# EAGLE schematic TMCM-1110_V21_eagle (EAGLE 6.5.0)

## Sheet 1 of 4
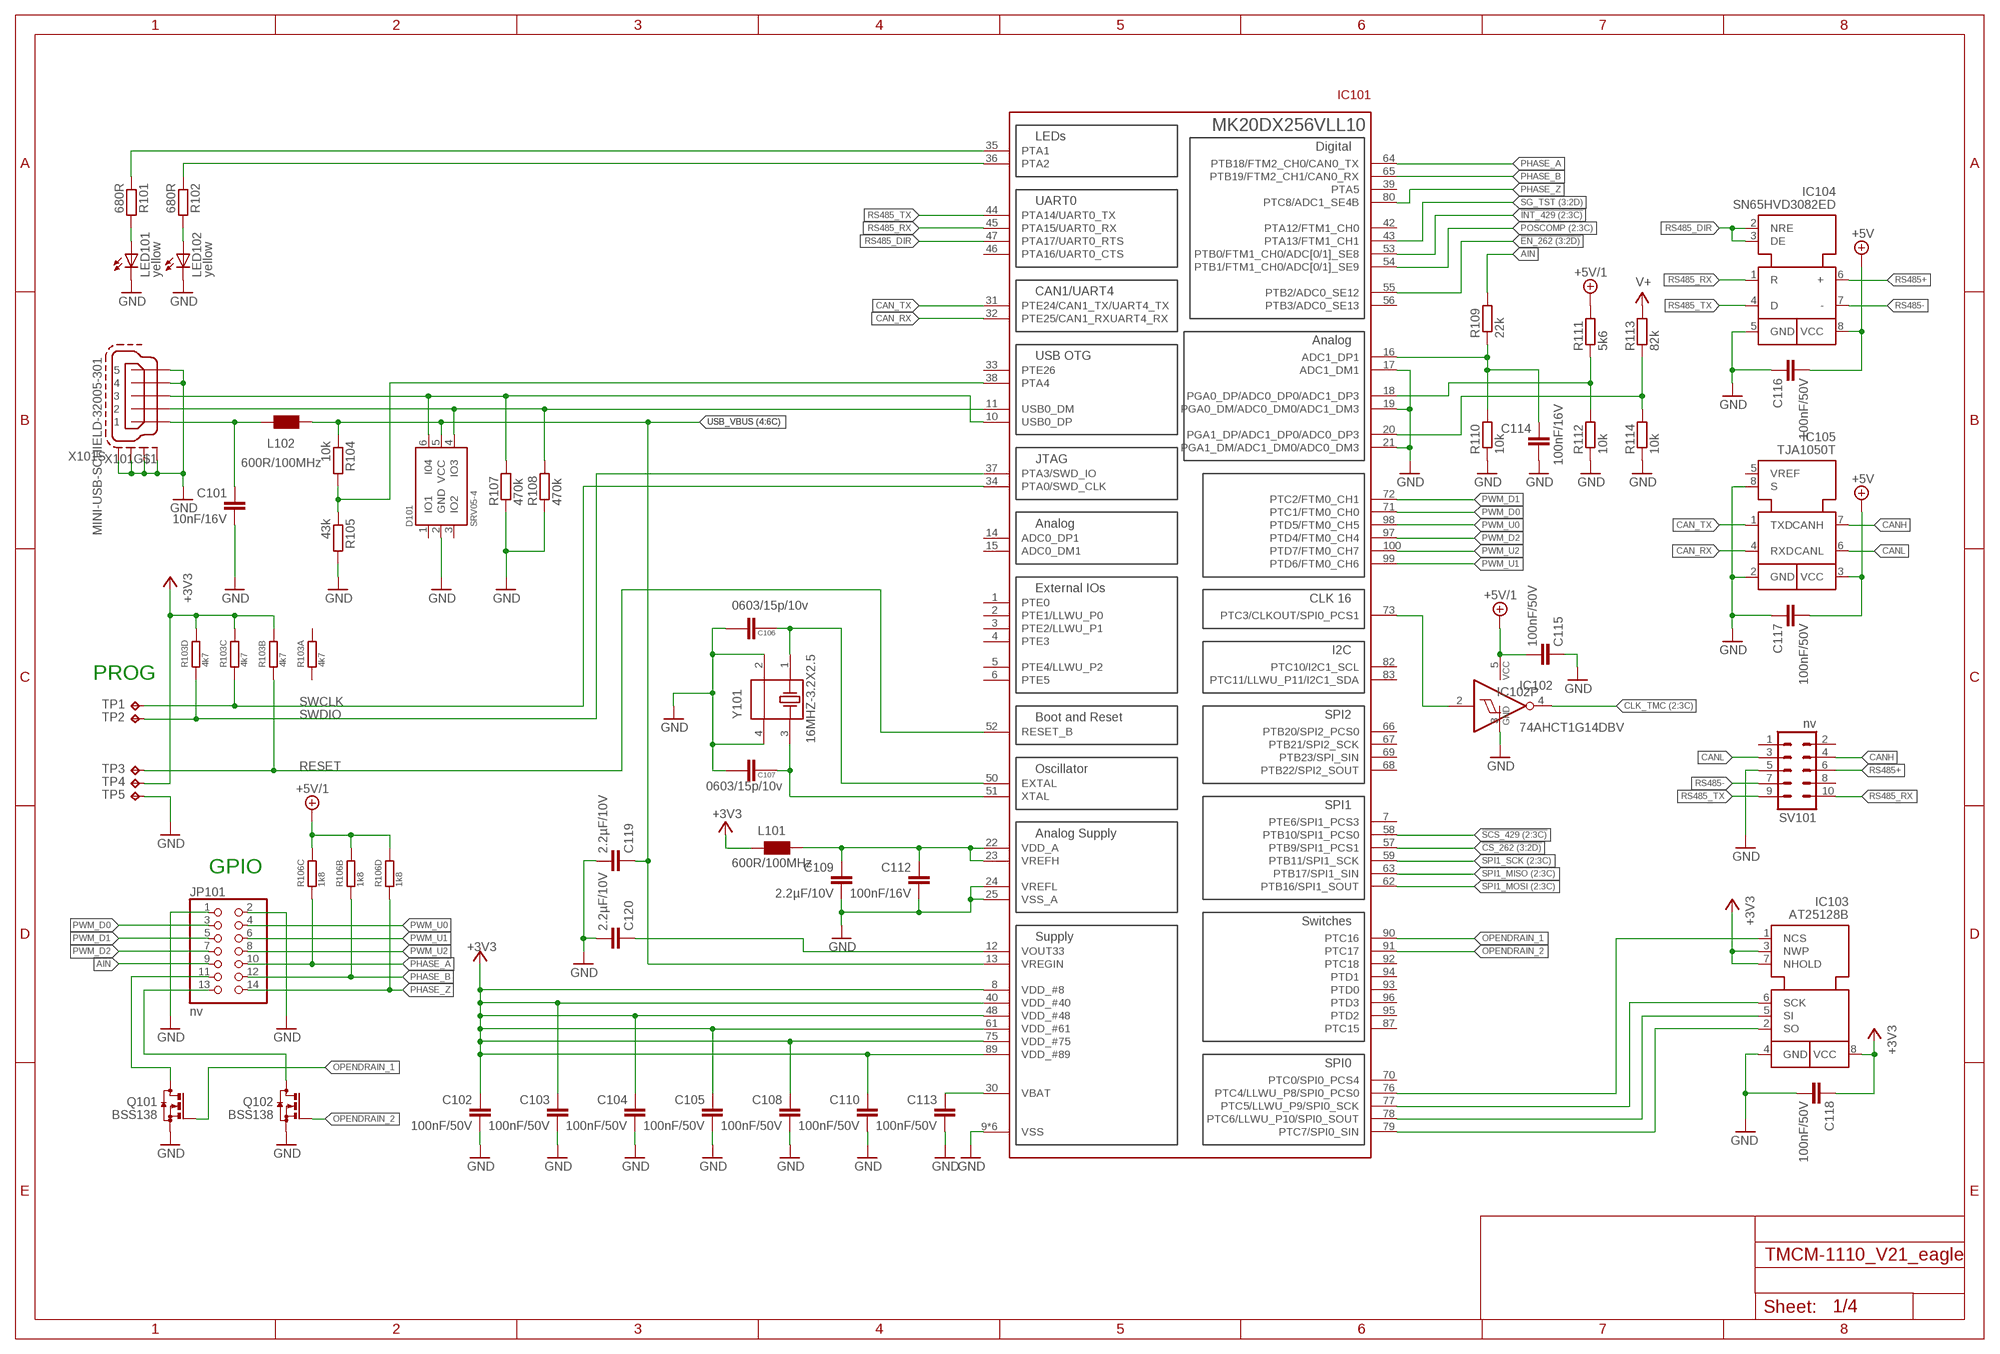
[diagram p0: schematic, sheet 1]

### Parts
C101  10nF/16V  C-EUC0603  [C0603]
C102  100nF/50V  C-EUC0603  [C0603]
C103  100nF/50V  C-EUC0603  [C0603]
C104  100nF/50V  C-EUC0603  [C0603]
C105  100nF/50V  C-EUC0603  [C0603]
C106  0603/15p/10v  C/0603  [0603]
C107  0603/15p/10v  C/0603  [0603]
C108  100nF/50V  C-EUC0603  [C0603]
C109  2.2µF/10V  C-EUC0603  [C0603]
C110  100nF/50V  C-EUC0603  [C0603]
C112  100nF/16V  C-EUC0603  [C0603]
C113  100nF/50V  C-EUC0603  [C0603]
C114  100nF/16V  C-EUC0603  [C0603]
C115  100nF/50V  C-EUC0603  [C0603]
C116  100nF/50V  C-EUC0603  [C0603]
C117  100nF/50V  C-EUC0603  [C0603]
C118  100nF/50V  C-EUC0603  [C0603]
C119  2.2µF/10V  C-EUC0603  [C0603]
C120  2.2µF/10V  C-EUC0603  [C0603]
D101  SRV05-4  [TMC_SOT23-6]
IC101  MK20DX256VLL10  [TMC_LQFP100]
IC102  74AHCT1G14DBV  [SOT23-5]
IC103  AT25128B  [SO8]
IC104  SN65HVD3082ED  [SO8]
IC105  TJA1050T  [SO8]
JP101  nv  PINHD-2X7  [2X07]
L101  600R/100MHz  WE-CBF_0603  [0603]
L102  600R/100MHz  WE-CBF_0603  [0603]
LED101  yellow  LEDCHIP-LED0603  [CHIP-LED0603]
LED102  yellow  LEDCHIP-LED0603  [CHIP-LED0603]
Q101  BSS138  [SOT23]
Q102  BSS138  [SOT23]
R101  680R  R-EU_R0603  [R0603]
R102  680R  R-EU_R0603  [R0603]
R103  4k7  R_NET_4X  [R_4X_1206]
R104  10k  R-EU_R0603  [R0603]
R105  43k  R-EU_R0603  [R0603]
R106  1k8  R_NET_4X  [R_4X_1206]
R107  470k  R-EU_R0603  [R0603]
R108  470k  R-EU_R0603  [R0603]
R109  22k  R-EU_R0603  [R0603]
R110  10k  R-EU_R0603  [R0603]
R111  5k6  R-EU_R0603  [R0603]
R112  10k  R-EU_R0603  [R0603]
R113  82k  R-EU_R0603  [R0603]
R114  10k  R-EU_R0603  [R0603]
SV101  nv  ML10  [ML10]
TP1  TPTP15SQ  [TP15SQ]
TP2  TPTP15SQ  [TP15SQ]
TP3  TPTP15SQ  [TP15SQ]
TP4  TPTP15SQ  [TP15SQ]
TP5  TPTP15SQ  [TP15SQ]
X101  MINI-USB-SCHIELD-32005-301  [32005-301]
Y101  16MHZ-3.2X2.5  MYLIB_CRYSTAL-16MHZ-3.2X2.5  [MYLIB_FA-238]

### Nets
!CS_262: IC101.57(PTB9/SPI1_PCS1) ; also sheet 3
!CS_EEPROM: IC101.76(PTC4/LLWU_P8/SPI0_PCS0) IC103.1(NCS)
!EN_262: IC101.55(PTB2/ADC0_SE12) ; also sheet 3
!INT_429: IC101.53(PTB0/FTM1_CH0/ADC[0/1]_SE8) ; also sheet 2
!SCS_429: IC101.58(PTB10/SPI1_PCS0) ; also sheet 2
+3V3: C102.1 C103.1 C104.1 C105.1 C108.1 C110.1 C118.1 IC101.8(VDD_#8) IC101.40(VDD_#40) IC101.48(VDD_#48) IC101.61(VDD_#61) IC101.75(VDD_#75) IC101.89(VDD_#89) IC103.3(NWP) IC103.7(NHOLD) IC103.8(VCC) L101.1 R103.P$5 R103.P$6 R103.P$7 TP4.TP ; also sheet 4
+5V: C116.2 C117.2 IC104.8(VCC) IC105.3(VCC) ; also sheet 3,4
+5V/1: C115.2 IC102.5(VCC) R106.P$5 R106.P$6 R106.P$7 R111.2 ; also sheet 2,4
AIN: JP101.9 R109.2
CAN_RX: IC101.32(PTE25/CAN1_RXUART4_RX) IC105.4(RXD)
CAN_TX: IC101.31(PTE24/CAN1_TX/UART4_TX) IC105.1(TXD)
CANH: IC105.7(CANH) SV101.4
CANL: IC105.6(CANL) SV101.3
CLK_TMC: IC102.4(O) ; also sheet 2,3
GND: C101.2 C102.2 C103.2 C104.2 C105.2 C106.1 C107.1 C108.2 C109.2 C110.2 C112.2 C113.2 C114.2 C115.1 C116.1 C117.1 C118.2 C119.2 C120.2 D101.2(GND) IC101.9(VSS) IC101.17(ADC1_DM1) IC101.19(PGA0_DM/ADC0_DM0/ADC1_DM3) IC101.21(PGA1_DM/ADC1_DM0/ADC0_DM3) IC101.24(VREFL) IC101.25(VSS_A) IC101.41(VSS) IC101.49(VSS) IC101.60(VSS) IC101.74(VSS) IC101.88(VSS) IC102.3(GND) IC103.4(GND) IC104.5(GND) IC105.2(GND) IC105.8(S) JP101.1 JP101.2 LED101.C LED102.C Q101.2(S) Q102.2(S) R105.2 R107.1 R108.1 R110.1 R112.1 R114.1 SV101.5 TP5.TP X101.4 X101.5 X101.M1(S:S1) X101.M2(S:S2) X101.M3(S:S3) X101.M4(S:S4) Y101.2 Y101.4 ; also sheet 2,3,4
N$17: IC101.73(PTC3/CLKOUT/SPI0_PCS1) IC102.2(I)
N$18: IC101.38(PTA4) R104.2 R105.1
N$19: JP101.11 Q101.3(D)
N$20: IC101.35(PTA1) R101.1
N$21 [GND]: D101.6(I04) IC101.10(USB0_DP) R107.2 X101.3
N$22 [GND]: D101.4(IO3) IC101.11(USB0_DM) R108.2 X101.2
N$23: LED101.A R101.2
N$24: LED102.A R102.2
N$25: C109.1 C112.1 IC101.22(VDD_A) IC101.23(VREFH) L101.2
N$26: IC101.36(PTA2) R102.1
N$27: C114.1 IC101.16(ADC1_DP1) R109.1 R110.2
N$28: C113.1 IC101.30(VBAT)
N$29: C106.2 IC101.50(EXTAL) Y101.1
N$30: C101.1 L102.1 X101.1
N$31: C107.2 IC101.51(XTAL) Y101.3
N$32: IC101.18(PGA0_DP/ADC0_DP0/ADC1_DP3) R111.1 R112.2
N$33: IC101.20(PGA1_DP/ADC1_DP0/ADC0_DP3) R113.1 R114.2
N$36: JP101.13 Q102.3(D)
N$45: C120.1 IC101.12(VOUT33)
OPENDRAIN_1: IC101.90(PTC16) Q101.1(G)
OPENDRAIN_2: IC101.91(PTC17) Q102.1(G)
PHASE_A: IC101.64(PTB18/FTM2_CH0/CAN0_TX) JP101.10 R106.P$3
PHASE_B: IC101.65(PTB19/FTM2_CH1/CAN0_RX) JP101.12 R106.P$2
PHASE_Z: IC101.80(PTC8/ADC1_SE4B) JP101.14 R106.P$4
POSCOMP: IC101.54(PTB1/FTM1_CH0/ADC[0/1]_SE9) ; also sheet 2
PWM_D0: IC101.71(PTC1/FTM0_CH0) JP101.3
PWM_D1: IC101.72(PTC2/FTM0_CH1) JP101.5
PWM_D2: IC101.97(PTD4/FTM0_CH4) JP101.7
PWM_U0: IC101.98(PTD5/FTM0_CH5) JP101.4
PWM_U1: IC101.99(PTD6/FTM0_CH6) JP101.6
PWM_U2: IC101.100(PTD7/FTM0_CH7) JP101.8
RESET: IC101.52(RESET_B) R103.P$2 TP3.TP
RS485+: IC104.6(+) SV101.6
RS485-: IC104.7(-) SV101.7
RS485_DIR: IC101.47(PTA17/UART0_RTS) IC104.2(NRE) IC104.3(DE)
RS485_RX: IC101.45(PTA15/UART0_RX) IC104.1(R) SV101.10
RS485_TX: IC101.44(PTA14/UART0_TX) IC104.4(D) SV101.9
SG_TST: IC101.43(PTA13/FTM1_CH1) ; also sheet 3
SPI0_MISO: IC101.79(PTC7/SPI0_SIN) IC103.2(SO)
SPI0_MOSI: IC101.78(PTC6/LLWU_P10/SPI0_SOUT) IC103.5(SI)
SPI0_SCK: IC101.77(PTC5/LLWU_P9/SPI0_SCK) IC103.6(SCK)
SPI1_MISO: IC101.63(PTB17/SPI1_SIN) ; also sheet 2,3
SPI1_MOSI: IC101.62(PTB16/SPI1_SOUT) ; also sheet 2,3
SPI1_SCK: IC101.59(PTB11/SPI1_SCK) ; also sheet 2,3
SWCLK: IC101.34(PTA0/SWD_CLK) R103.P$3 TP1.TP
SWDIO: IC101.37(PTA3/SWD_IO) R103.P$4 TP2.TP
USB_VBUS: C119.1 D101.5(VCC) IC101.13(VREGIN) L102.2 R104.1 ; also sheet 4
V+: R113.2 ; also sheet 3,4
Unconnected: D101.1(IO1) D101.3(IO2) IC101.1(PTE0) IC101.2(PTE1/LLWU_P0) IC101.3(PTE2/LLWU_P1) IC101.4(PTE3) IC101.5(PTE4/LLWU_P2) IC101.6(PTE5) IC101.7(PTE6/SPI1_PCS3) IC101.14(ADC0_DP1) IC101.15(ADC0_DM1) IC101.33(PTE26) IC101.39(PTA5) IC101.42(PTA12/FTM1_CH0) IC101.46(PTA16/UART0_CTS) IC101.56(PTB3/ADC0_SE13) IC101.66(PTB20/SPI2_PCS0) IC101.67(PTB21/SPI2_SCK) IC101.68(PTB22/SPI2_SOUT) IC101.69(PTB23/SPI_SIN) IC101.70(PTC0/SPI0_PCS4) IC101.82(PTC10/I2C1_SCL) IC101.83(PTC11/LLWU_P11/I2C1_SDA) IC101.87(PTC15) IC101.92(PTC18) IC101.93(PTD0) IC101.94(PTD1) IC101.95(PTD2) IC101.96(PTD3) IC105.5(VREF) R103.P$1 R103.P$8 R106.P$1 R106.P$8 SV101.1 SV101.2 SV101.8

### Notes on the sheet
- PROG
- GPIO

## Sheet 2 of 4
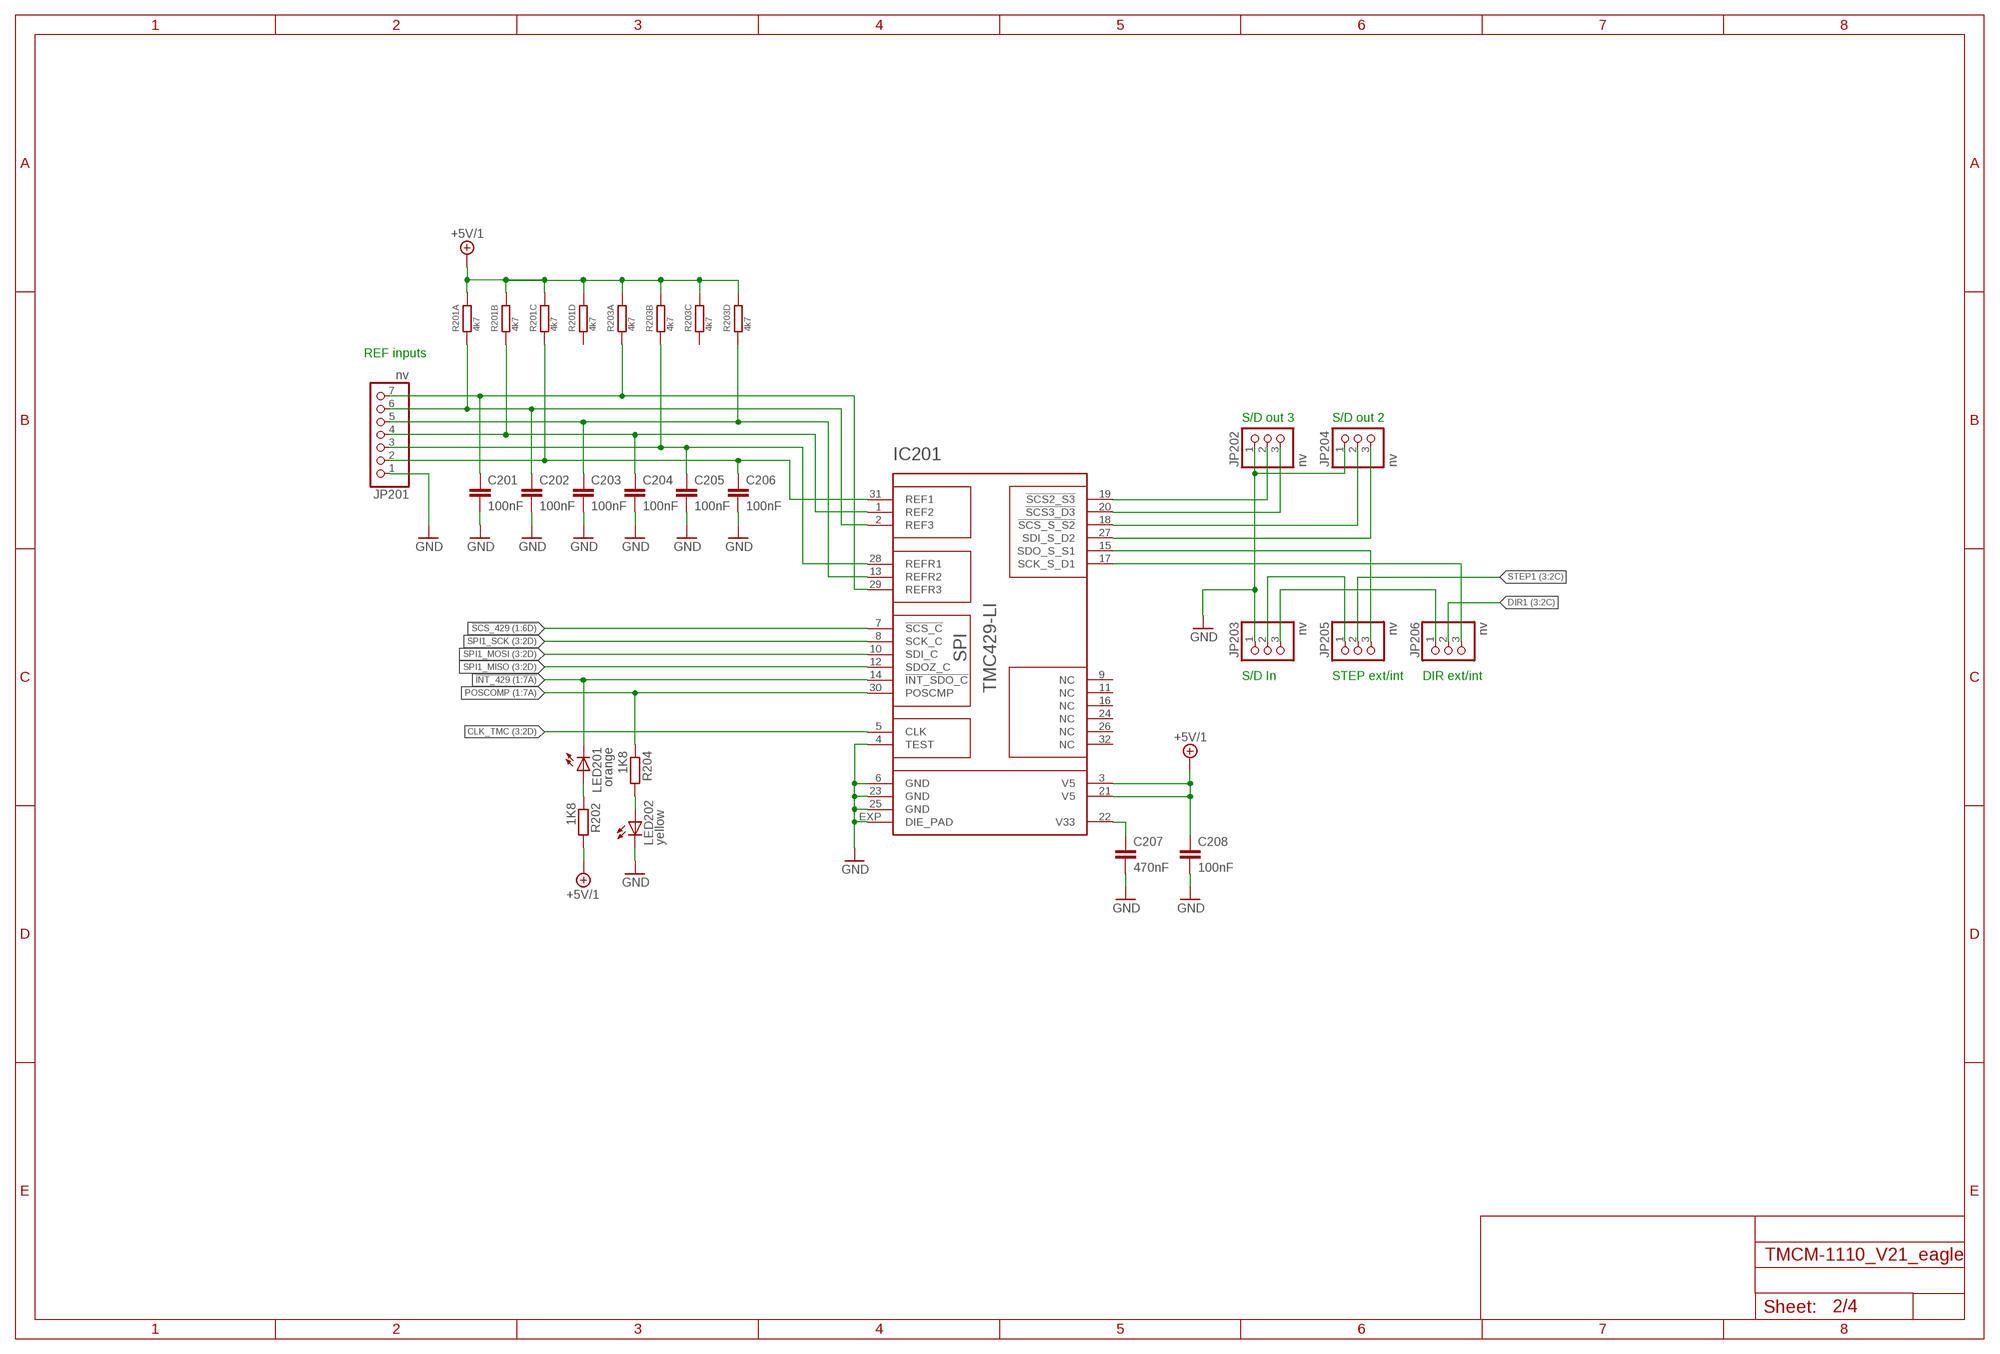
[diagram p1: schematic, sheet 2]

### Parts
C201  100nF  C-EUC0603  [C0603]
C202  100nF  C-EUC0603  [C0603]
C203  100nF  C-EUC0603  [C0603]
C204  100nF  C-EUC0603  [C0603]
C205  100nF  C-EUC0603  [C0603]
C206  100nF  C-EUC0603  [C0603]
C207  470nF  C-EUC0603  [C0603]
C208  100nF  C-EUC0603  [C0603]
IC201  TMC429-LI  [QFN32_5X5]
JP201  nv  PINHD-1X7  [1X07]
JP202  nv  PINHD-1X3  [1X03]
JP203  nv  PINHD-1X3  [1X03]
JP204  nv  PINHD-1X3  [1X03]
JP205  nv  PINHD-1X3  [1X03]
JP206  nv  PINHD-1X3  [1X03]
LED201  orange  LEDCHIP-LED0603  [CHIP-LED0603]
LED202  yellow  LEDCHIP-LED0603  [CHIP-LED0603]
R201  4k7  R_NET_4X  [R_4X_1206]
R202  1K8  R-EU_R0603  [R0603]
R203  4k7  R_NET_4X  [R_4X_1206]
R204  1K8  R-EU_R0603  [R0603]

### Nets
!INT_429: IC201.14(!INT_SDO_C) LED201.C ; also sheet 1
!SCS_429: IC201.7(!SCS_C) ; also sheet 1
+5V/1: C208.1 IC201.3(V5) IC201.21(V5) R201.P$5 R201.P$6 R201.P$7 R201.P$8 R202.2 R203.P$5 R203.P$6 R203.P$7 R203.P$8 ; also sheet 1,4
CLK_TMC: IC201.5(CLK) ; also sheet 1,3
DIR1: JP206.2 ; also sheet 3
DIR1_429: IC201.17(SCK_S_D1) JP206.3
DIR1_EXT: JP203.3 JP206.1
DIR2: IC201.27(SDI_S_D2) JP204.3
DIR3: IC201.20(!SCS3_D3) JP202.3
GND: C201.2 C202.2 C203.2 C204.2 C205.2 C206.2 C207.2 C208.2 IC201.4(TEST) IC201.6(GND) IC201.23(GND) IC201.25(GND) IC201.EXP(DIE_PAD) JP201.1 JP202.1 JP203.1 JP204.1 LED202.C ; also sheet 1,3,4
N$15: LED202.A R204.2
N$16: LED201.A R202.1
POSCOMP: IC201.30(POSCMP) R204.1 ; also sheet 1
REF1: C206.1 IC201.31(REF1) JP201.2 R201.P$3
REF2: C204.1 IC201.1(REF2) JP201.4 R201.P$2
REF3: C202.1 IC201.2(REF3) JP201.6 R201.P$1
REFR1: C205.1 IC201.28(REFR1) JP201.3 R203.P$2
REFR2: C203.1 IC201.13(REFR2) JP201.5 R203.P$4
REFR3: C201.1 IC201.29(REFR3) JP201.7 R203.P$1
SPI1_MISO: IC201.12(SDOZ_C) ; also sheet 1,3
SPI1_MOSI: IC201.10(SDI_C) ; also sheet 1,3
SPI1_SCK: IC201.8(SCK_C) ; also sheet 1,3
STEP1: JP205.2 ; also sheet 3
STEP1_429: IC201.15(SDO_S_S1) JP205.3
STEP1_EXT: JP203.2 JP205.1
STEP2: IC201.18(!SCS_S_S2) JP204.2
STEP3: IC201.19(!SCS2_S3) JP202.2
V33: C207.1 IC201.22(V33)
Unconnected: IC201.9(NC) IC201.11(NC) IC201.16(NC) IC201.24(NC) IC201.26(NC) IC201.32(NC) R201.P$4 R203.P$3

### Notes on the sheet
- REF inputs
- S/D out 3 | S/D out 2
- S/D In | STEP ext/int | DIR ext/int

## Sheet 3 of 4
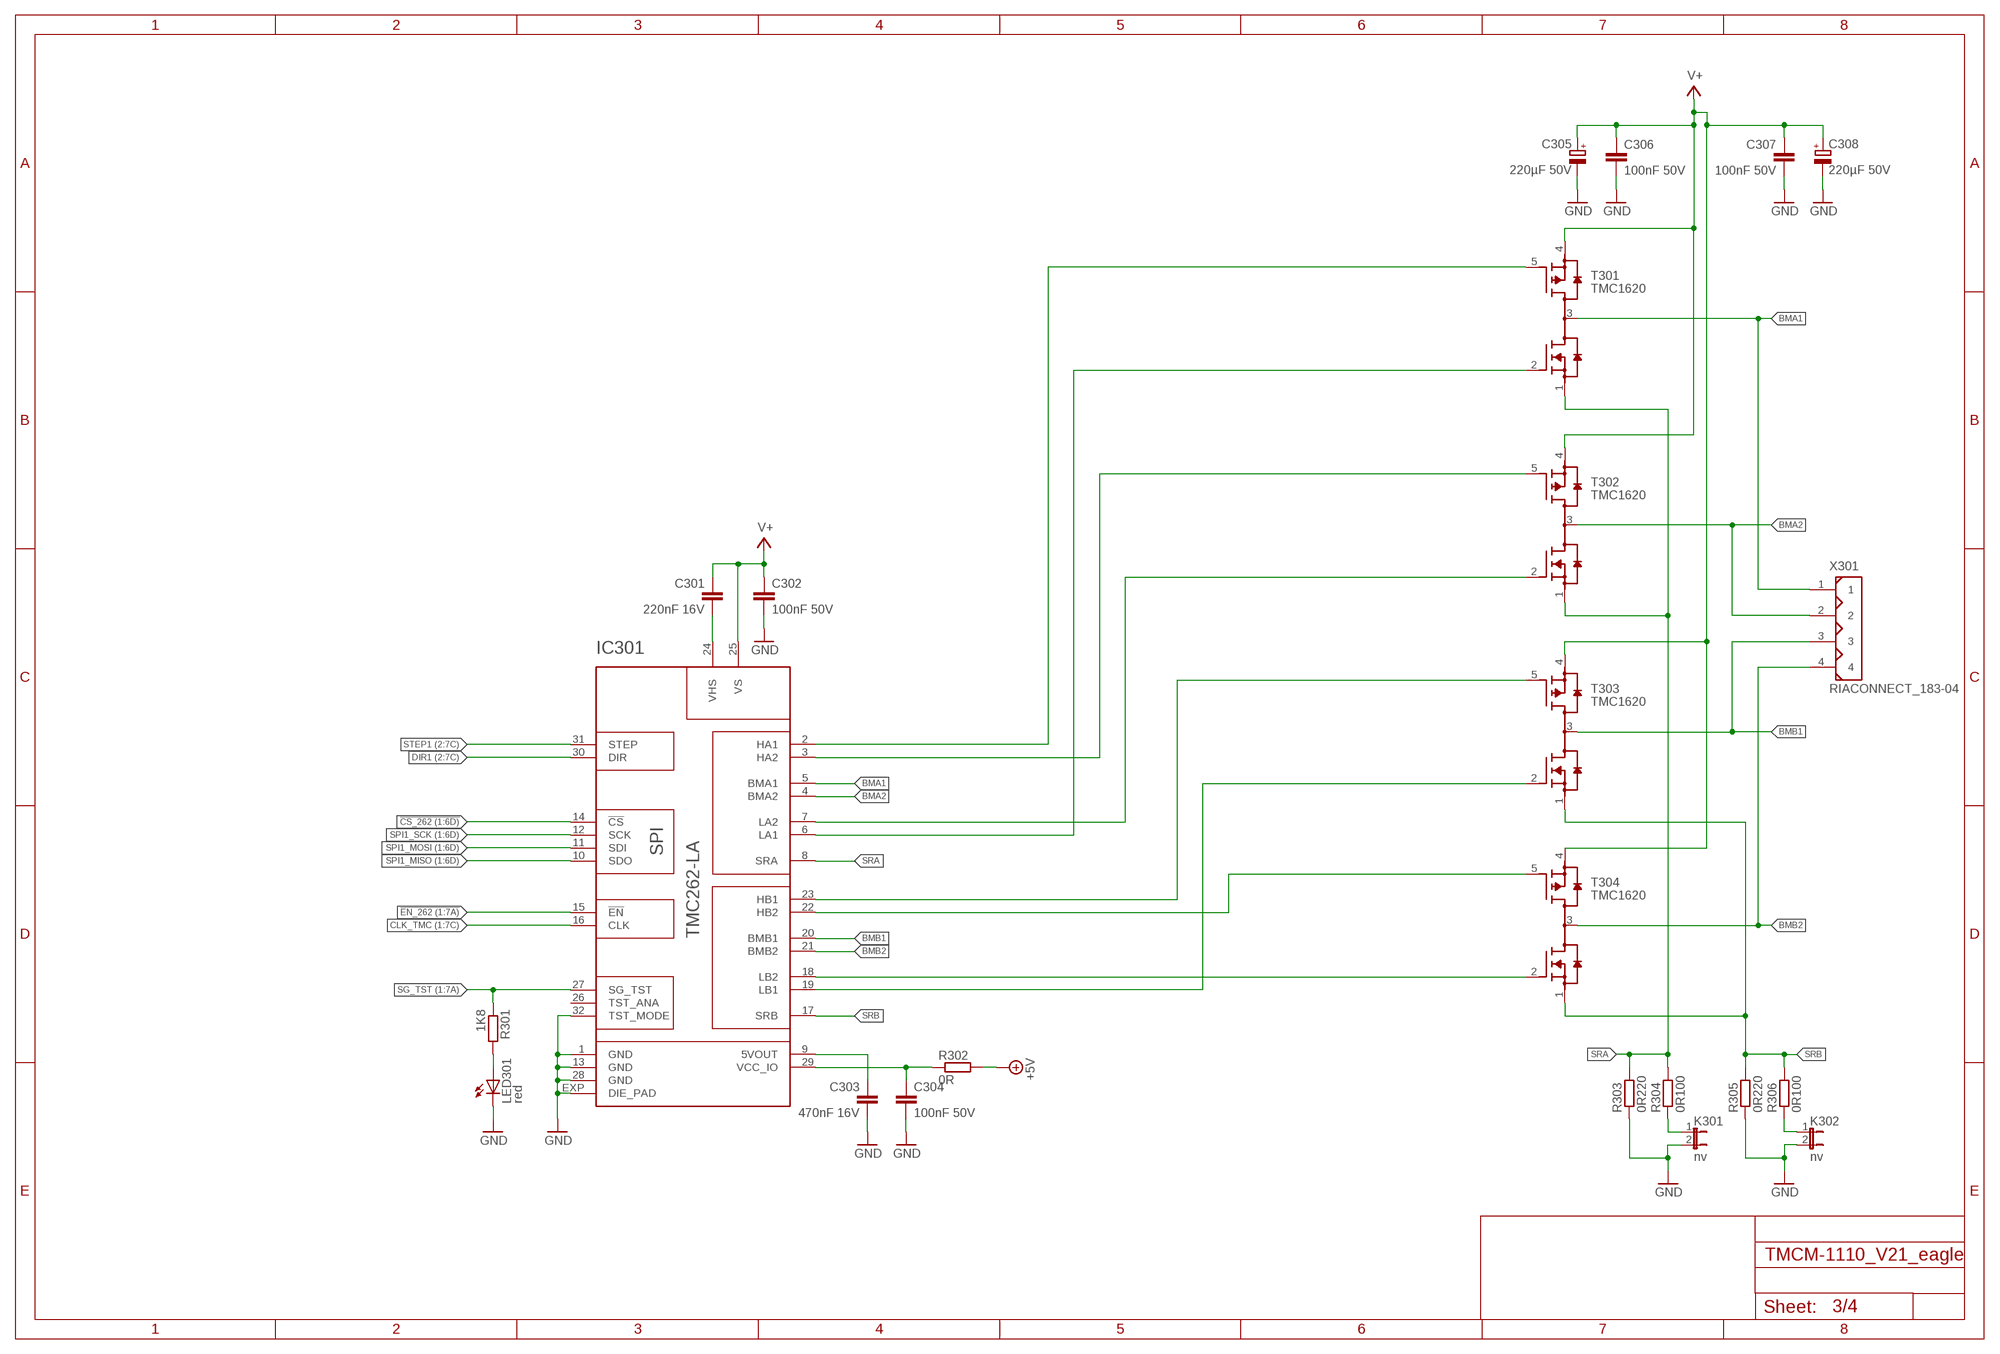
[diagram p2: schematic, sheet 3]

### Parts
C301  220nF 16V  C-EUC0603  [C0603]
C302  100nF 50V  C-EUC0603  [C0603]
C303  470nF 16V  C-EUC0603  [C0603]
C304  100nF 50V  C-EUC0603  [C0603]
C305  220µF 50V  CPOL-EUE5-10.5  [E5-10,5]
C306  100nF 50V  C-EUC0603  [C0603]
C307  100nF 50V  C-EUC0603  [C0603]
C308  220µF 50V  CPOL-EUE5-10.5  [E5-10,5]
IC301  TMC262-LA  [QFN32_5X5]
K301  nv  JP1E  [JP1]
K302  nv  JP1E  [JP1]
LED301  red  LEDCHIP-LED0603  [CHIP-LED0603]
R301  1K8  R-EU_R0603  [R0603]
R302  0R  R-EU_R0603  [R0603]
R303  0R220  R-EU_R1206  [R1206]
R304  0R100  R-EU_R1206  [R1206]
R305  0R220  R-EU_R1206  [R1206]
R306  0R100  R-EU_R1206  [R1206]
T301  TMC1620  [DUAL_DPAK_4L]
T302  TMC1620  [DUAL_DPAK_4L]
T303  TMC1620  [DUAL_DPAK_4L]
T304  TMC1620  [DUAL_DPAK_4L]
X301  RIACONNECT_183-04  [RIACONNECT_183-04]

### Nets
!CS_262: IC301.14(!CS) ; also sheet 1
!EN_262: IC301.15(!EN) ; also sheet 1
+5V: R302.2 ; also sheet 1,4
BMA1: IC301.5(BMA1) T301.3(D_NP) X301.1
BMA2: IC301.4(BMA2) T302.3(D_NP) X301.2
BMB1: IC301.20(BMB1) T303.3(D_NP) X301.3
BMB2: IC301.21(BMB2) T304.3(D_NP) X301.4
CLK_TMC: IC301.16(CLK) ; also sheet 1,2
DIR1: IC301.30(DIR) ; also sheet 2
GND: C302.2 C303.2 C304.2 C305.- C306.2 C307.2 C308.- IC301.1(GND) IC301.13(GND) IC301.28(GND) IC301.32(TST_MODE) IC301.EXP(DIE_PAD) K301.2 K302.2 LED301.C R303.1 R305.1 ; also sheet 1,2,4
N$1: LED301.A R301.2
N$2: C304.1 IC301.29(VCC_IO) R302.1
N$3: C303.1 IC301.9(5VOUT)
N$4: C301.2 IC301.24(VHS)
N$5: IC301.2(HA1) T301.5(G_P)
N$6: IC301.3(HA2) T302.5(G_P)
N$7: IC301.7(LA2) T302.2(G_N)
N$8: IC301.6(LA1) T301.2(G_N)
N$9: IC301.23(HB1) T303.5(G_P)
N$10: IC301.22(HB2) T304.5(G_P)
N$11: IC301.19(LB1) T303.2(G_N)
N$12: IC301.18(LB2) T304.2(G_N)
N$13: K302.1 R306.1
N$14: K301.1 R304.1
SG_TST: IC301.27(SG_TST) R301.1 ; also sheet 1
SPI1_MISO: IC301.10(SDO) ; also sheet 1,2
SPI1_MOSI: IC301.11(SDI) ; also sheet 1,2
SPI1_SCK: IC301.12(SCK) ; also sheet 1,2
SRA: IC301.8(SRA) R303.2 R304.2 T301.1(S_N) T302.1(S_N)
SRB: IC301.17(SRB) R305.2 R306.2 T303.1(S_N) T304.1(S_N)
STEP1: IC301.31(STEP) ; also sheet 2
V+: C301.1 C302.1 C305.+ C306.1 C307.1 C308.+ IC301.25(VS) T301.4(S_P) T302.4(S_P) T303.4(S_P) T304.4(S_P) ; also sheet 1,4
Unconnected: IC301.26(TST_ANA)

## Sheet 4 of 4
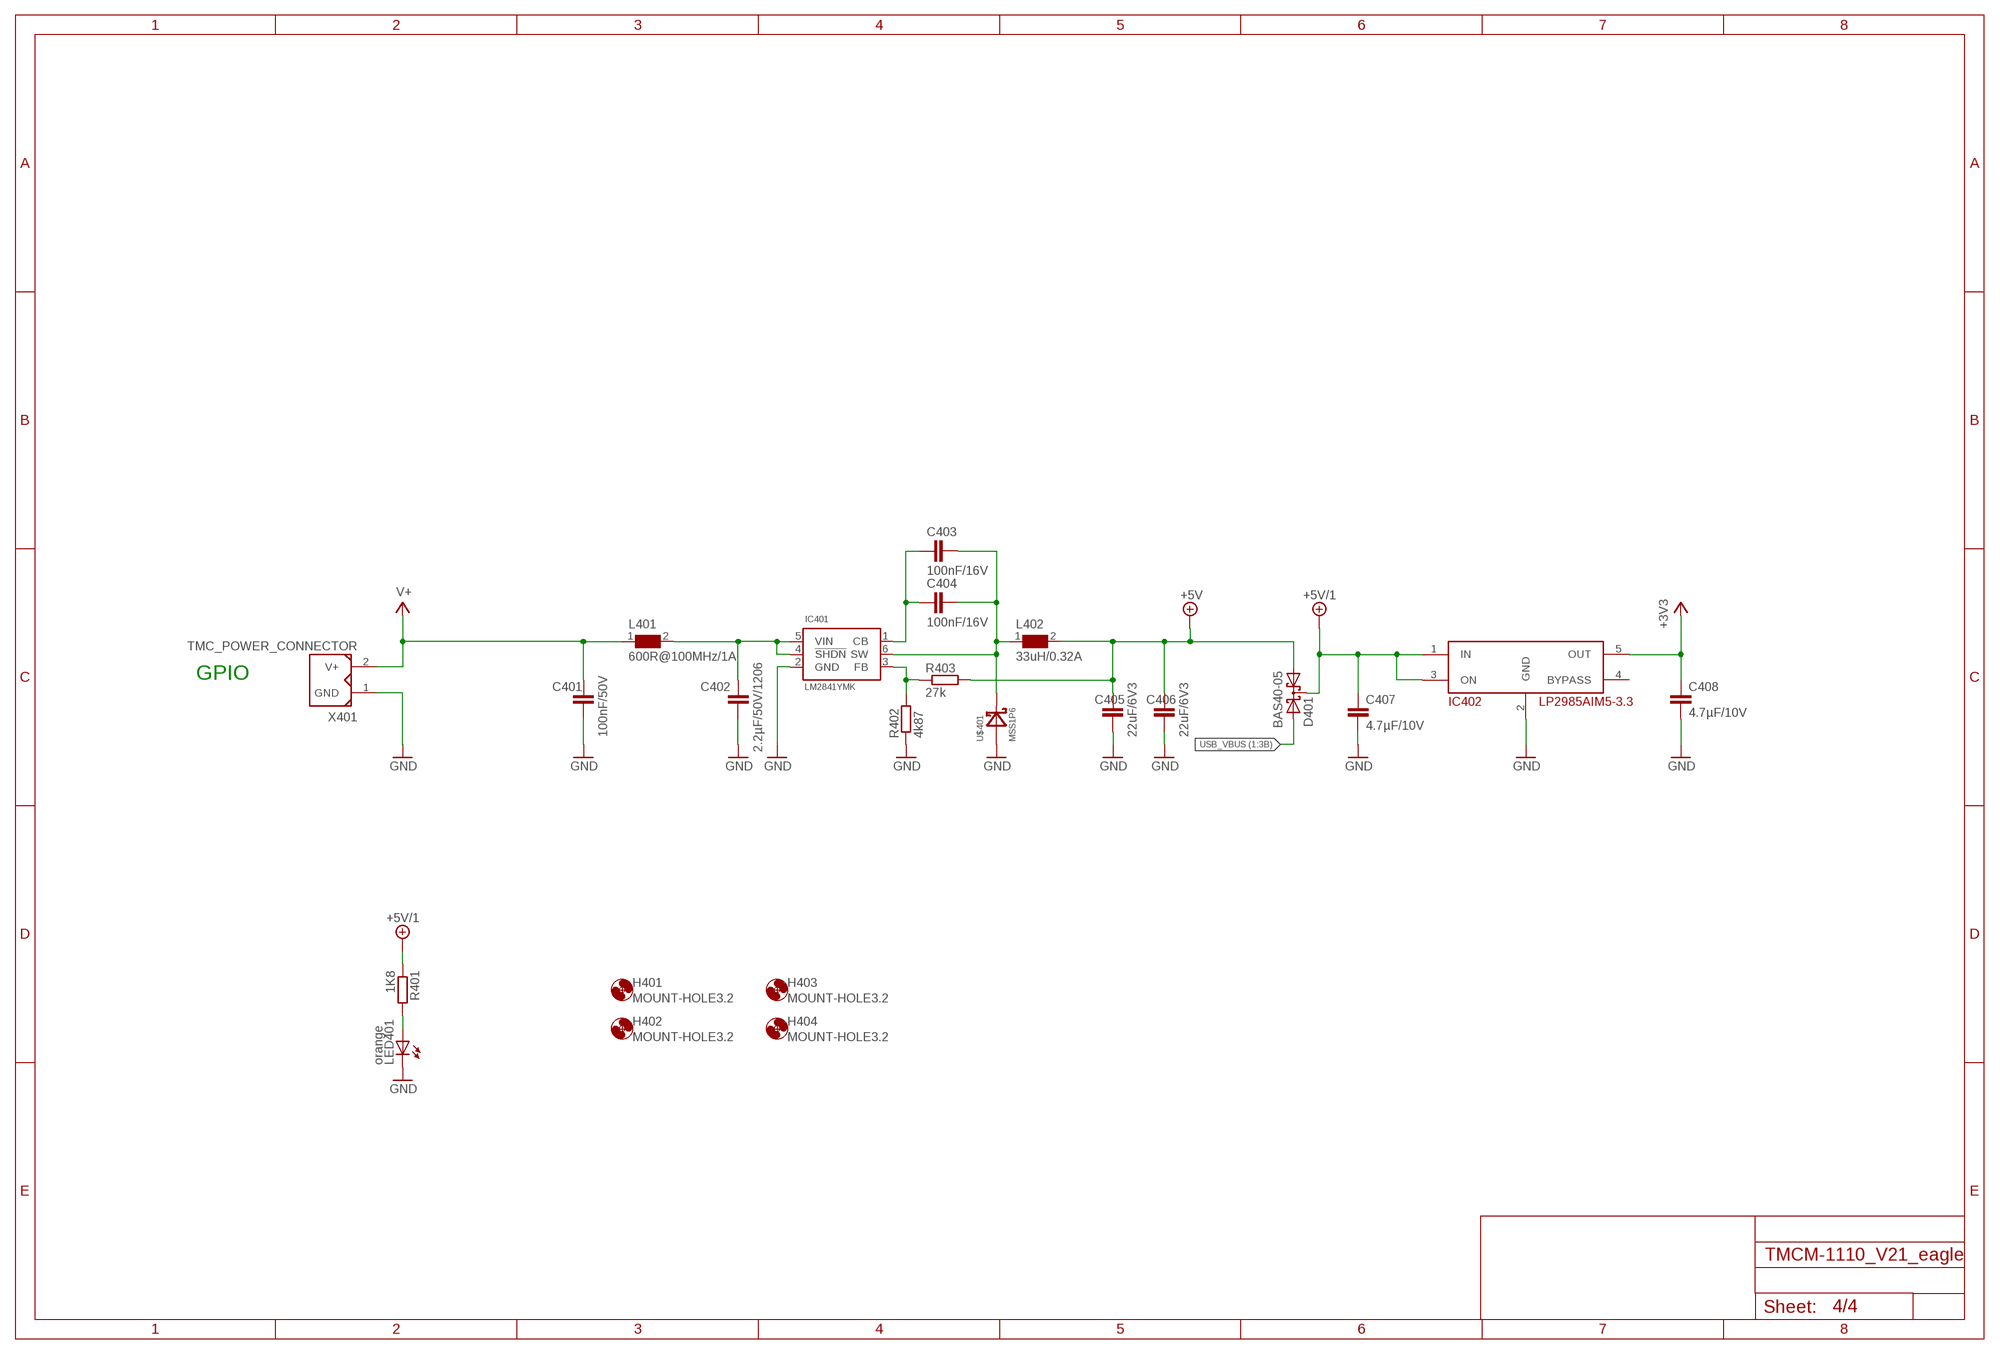
[diagram p3: schematic, sheet 4]

### Parts
C401  100nF/50V  C-EUC0603  [C0603]
C402  2.2µF/50V/1206  C-EUC1206  [C1206]
C403  100nF/16V  C-EUC0603  [C0603]
C404  100nF/16V  C-EUC0603  [C0603]
C405  22uF/6V3  C-EUC0805  [C0805]
C406  22uF/6V3  C-EUC0805  [C0805]
C407  4.7µF/10V  C-EUC0603  [C0603]
C408  4.7µF/10V  C-EUC0603  [C0603]
D401  BAS40-05  [SOT23]
H401  MOUNT-HOLE3.2  [3,2]
H402  MOUNT-HOLE3.2  [3,2]
H403  MOUNT-HOLE3.2  [3,2]
H404  MOUNT-HOLE3.2  [3,2]
IC401  LM2841YMK  [TMC_SOT23-6]
IC402  LP2985AIM5-3.3  [SOT23-5]
L401  600R@100MHz/1A  WE-CBF_0603  [0603]
L402  33uH/0.32A  WE-TPC_3816  [WE-TPC_3816]
LED401  orange  LEDCHIP-LED0603  [CHIP-LED0603]
R401  1K8  R-EU_R0603  [R0603]
R402  4k87  R-EU_R0603  [R0603]
R403  27k  R-EU_R0603  [R0603]
U$401  MSS1P6  [MICRO_SMP]
X401  TMC_POWER_CONNECTOR  [RIACONNECT_320-02]

### Nets
+3V3: C408.1 IC402.5(OUT) ; also sheet 1
+5V: C405.1 C406.1 D401.1(A1) L402.2 R403.2 ; also sheet 1,3
+5V/1: C407.1 D401.3(C) IC402.1(IN) IC402.3(ON) R401.1 ; also sheet 1,2
GND: C401.2 C402.2 C405.2 C406.2 C407.2 C408.2 IC401.2(GND) IC402.2(GND) LED401.C R402.1 U$401.A X401.1(GND) ; also sheet 1,2,3
N$34: C403.1 C404.1 IC401.1(CB)
N$35: C403.2 C404.2 IC401.6(SW) L402.1 U$401.C
N$37: C402.1 IC401.4(!SHDN) IC401.5(VIN) L401.2
N$38: LED401.A R401.2
N$40: IC401.3(FB) R402.2 R403.1
USB_VBUS: D401.2(A2) ; also sheet 1
V+: C401.1 L401.1 X401.2(V+) ; also sheet 1,3
Unconnected: IC402.4(BYPASS)

### Notes on the sheet
- GPIO

## Library data of the parts
C101-C105 C108-C110 C112-C120 C201-C208 C301-C304 C306 C307 C401-C404 C407 C408 = rcl:C-EU: CAPACITOR, European symbol
C106 C107 = _TMC_TE_RCL:C
C305 C308 = rcl:CPOL-EU: POLARIZED CAPACITOR, European symbol
C405 C406 = rcl:C-EU: CAPACITOR, European symbol; HERSTELLER: KEMET; HERST_NR: C0805C226M9PAC7800
D101 = TMC_IC:SRV05-4
D401 = diode:BAS40-05: Silicon Schottky Diodes General-purpose diode for high-speed switching
H401-H404 = holes:MOUNT-HOLE: MOUNTING HOLE with drill center marker
IC101 = TMC_IC:MK20DX256VLL10
IC102 = 74xx-little-us:74*1G14: Single Schmitt-Trigger Inverter Gate
IC103 = stepRocker:AT25128B
IC104 = stepRocker:SN65HVD3082ED: RS484-Transceiver
IC105 = stepRocker:TJA1050T: CAN-Transceive
IC201 = stepRocker:TMC429-LI: TRINAMIC 3-axis universal motion controller for stepper motor drivers Information given in this library is believed to be accurate and reliable. However no warranty is given for its correctness. Datasheet for TMC429 <http://www.trinamic.com/tmc/media/Downloads/integrated_circuits/TMC429/TMC429_datasheet.pdf> Description 3-axis universal motion controller for stepper motor drivers The TMC429 is a miniaturized low cost, high performance stepper motor controller for up to three motors. It integrates all real time critical tasks in reliable, dedicated hardware: An integrated motion ramp profile generator as well as an adaptable microstep sequencer with microstep RAM table. Advanced stop- and reference switch handling allows for precise and fast referencing as well as on-the-fly position checking. Automatic motor current control gives high motor dynamics while saving energy. The interrupt output can generate precise position pulses. The TMC429 is fully downwards compatible to the TMC428. The TMC429 connects to the recent coolStep™ drivers (TMC260, TMC262 and TMC389) via Step- & Direction signals (S/D) or to the classic TRINAMIC drivers TMC236, TMC239, TMC246 and TMC249 via SPI™ . The communication with the host microcontroller is done with an extra SPI™ interface. The host just needs to do high-level control tasks, e.g. giving the command: Drive motor 2 to position 1000. The TMC429 automatically calculates the motion ramp based on velocity and acceleration parameters. TMC 429 - the small but intelligent controller Miniaturized low cost 3 axes motor controller High-performance micro stepping SPI™ host interface with easy-to-use protocol Step-/Direction or SPI™ driver interface On-the-fly alteration of position set point Specifications Main characteristics controls up to three stepper motors selectable driver interface: Step&Direction or SPI different types of SPI™ stepper motor driver chips may by mixed within a single daisy chain communication on demand minimizes traffic to the SPI™ stepper motor drivers chain allows read-out of driver status information programmable SPI™ data rates up to 1 Mbit/s wide range for clock frequency - can use CPU clock up to 32 MHz internal 24 bit wide position counters full step frequencies up to 20 kHz individual micro step resolution of {64, 32, 16, 8, 4, 2, 1} micro steps (SPI mode) programmable 6 bit micro step table with up to 64 entries for a quarter sine wave period (SPI mode) on-the-fly alteration of target motion parameters (like position, velocity, acceleration) read-out facility for current motion parameters (position, velocity, acceleration) integrated power-on-reset NEW: "position reached" trigger output Interface Configurable interface for SPI™ motor drivers (e.g. TMC236, TMC239, TMC246, TMC249) Step-/Direction interface for universal motor drivers (e.g. TMC260, TMC262, TMC389) SPI™ host interface Electrical Data 3.3V or 5V operation with CMOS / TTL compatible IOs (all inputs Schmitt-Trigger) Power down mode (100 µA) with transparent wake-up for normal operation (typ. 10 mA @ 16 MHz) Package Chip size 32 pin QFN 5x5mm SOP24 Ultra small 16 pin SSOP (TMC428-I compatible, reduced TMC429 functionality)
IC301 = stepRocker:TMC262-LA: TRINAMIC Energy efficient microstep driver for external MOSFET's for up to 6A with coolStep™ Information given in this library is believed to be accurate and reliable. However no warranty is given for its correctness. Datasheet for TMC260/261/262 <http://www.trinamic.com/tmc/media/Downloads/integrated_circuits/TMC262/TMC260_TMC261_TMC262_datasheet.pdf> Description Energy efficient microstep driver for external MOSFET's for up to 6A with coolStep™ The TMC262 is the first energy efficient high current high precision microstepping driver IC for bipolar stepper motors. The unique high resolution sensorless load detection stallGuard2™ is used to for the world™s first integrated load dependent current control feature called coolStep™. The ability to read out the load and detect an overload makes the TMC262 an optimum choice for drives where a high reliability is desired at a low cost. The new patented spreadCycle PWM mixed decay chopper scheme ensures best zero crossing performance as well as high speed operation. The TMC262 can be driven with Step & Direction signals as well as by serial SPI™ interface. Using the microPlyer allows to operate the motor with highest 256 ™Step smoothness reducing the input frequency to 16 ™Steps. A full set of protection and diagnostic features makes this device very rugged. It directly drives external MOSFETs for currents of up to 6A. This way it reaches highest energy efficiency and allows driving of a high motor current without cooling measures even at high environment temperatures. Specifications Main characteristics 2-phase bipolar stepper motor driver stallGuard2™ sensorless load detection coolStep™ load dependent current control save up to 80% energy spreadCycle hysteresis PWM chopper best current zero crossing performance best sine wave form 256 ™Steps/fullstep (51200 pos/rev.) with a standard 200 step motor microPlyer 16-to-256 ™Step multiplyer full protection and diagnostics lowest power dissipation programmable slope control for low EME standby and shutdown mode stall / load detection output Low power consumption via low RDS-ON power stage Interface Step & Direction easy-to-use SPI™ (20bit) Electrical Data up to 6A coil current (peak) with just 4 external dual MOSFETS 9V to 60V motor supply full 48V +10% industry voltage support 3.3V or 5V operation for digital part Package QFN32 5x5 mm² chip size package RoHS compliant
IC401 = TMC_IC:LM2841YMK: 300mA/600 mA up to 42V Input Step-Down DC/DC Regulator in Thin SOT-23
IC402 = stepRocker:LP2985AIM5-3.3
JP101 = pinhead:PINHD-2X7: PIN HEADER
JP201 = pinhead:PINHD-1X7: PIN HEADER
JP202-JP206 = pinhead:PINHD-1X3: PIN HEADER
K301 K302 = jumper:JP1E: JUMPER
L101 L102 = wuerth-elektronik:WE-CBF: SMD EMI Suppression Ferrite Beads - excellent anti-EMI properties - low DCR - impedances till 3000 ohms - rated current up to 6 A
L401 = Wuerth_Elektronik_eiSos_V6:WE-CBF: SMD EMI Suppression Ferrite Beads WE-CBF - Excellent anti-EMI properties - Low DC-restistance - Impedances till 3000 ohms - Rated current up to 6 A -- Reliable Ni-Sn electrodes -- Perfect as data lined filter and for uncoupling of distribution voltage; HERSTELLER: Würth; HERST_NR: 742792651
L402 = Wuerth_Elektronik_eiSos_V6:WE-TPC: Shielded Tiny Power Inductor WE-TPC - Extremely flat power inductor - High current capability - High reliability and perfect soldering characteristics because of integrated soldering pad - magnetically shielded -- Portable power like PDA, digital camera, PCMICA-cards and displays -- DC/DC-converter -- Recommended for switching regulator IC's from Linear Technology, National Semiconductor, Texas Instruments and Fairchild Semiconductor; HERSTELLER: Würth; HERST_NR: 744031330
LED101 LED102 LED201 LED202 LED301 LED401 = led:LED: LED OSRAM: - CHIPLED LG R971, LG N971, LY N971, LG Q971, LY Q971, LO R971, LY R971 LH N974, LH R974 LS Q976, LO Q976, LY Q976 LO Q996 - Hyper CHIPLED LW Q18S LB Q993, LB Q99A, LB R99A - SideLED LS A670, LO A670, LY A670, LG A670, LP A670 LB A673, LV A673, LT A673, LW A673 LH A674 LY A675 LS A676, LA A676, LO A676, LY A676, LW A676 LS A679, LY A679, LG A679 - Hyper Micro SIDELED® LS Y876, LA Y876, LO Y876, LY Y876 LT Y87S - SmartLED LW L88C, LW L88S LB L89C, LB L89S, LG L890 LS L89K, LO L89K, LY L89K LS L896, LA L896, LO L896, LY L896 - TOPLED LS T670, LO T670, LY T670, LG T670, LP T670 LSG T670, LSP T670, LSY T670, LOP T670, LYG T670 LG T671, LOG T671, LSG T671 LB T673, LV T673, LT T673, LW T673 LH T674 LS T676, LA T676, LO T676, LY T676, LB T676, LH T676, LSB T676, LW T676 LB T67C, LV T67C, LT T67C, LS T67K, LO T67K, LY T67K, LW E67C LS E67B, LA E67B, LO E67B, LY E67B, LB E67C, LV E67C, LT E67C LW T67C LS T679, LY T679, LG T679 LS T770, LO T770, LY T770, LG T770, LP T770 LB T773, LV T773, LT T773, LW T773 LH T774 LS E675, LA E675, LY E675, LS T675 LS T776, LA T776, LO T776, LY T776, LB T776 LHGB T686 LT T68C, LB T68C - Hyper Mini TOPLED® LB M676 - Mini TOPLED Santana® LG M470 LS M47K, LO M47K, LY M47K Source: http://www.osram.convergy.de LUXEON: - LUMILED® LXK2-PW12-R00, LXK2-PW12-S00, LXK2-PW14-U00, LXK2-PW14-V00 LXK2-PM12-R00, LXK2-PM12-S00, LXK2-PM14-U00 LXK2-PE12-Q00, LXK2-PE12-R00, LXK2-PE12-S00, LXK2-PE14-T00, LXK2-PE14-U00 LXK2-PB12-K00, LXK2-PB12-L00, LXK2-PB12-M00, LXK2-PB14-N00, LXK2-PB14-P00, LXK2-PB14-Q00 LXK2-PR12-L00, LXK2-PR12-M00, LXK2-PR14-Q00, LXK2-PR14-R00 LXK2-PD12-Q00, LXK2-PD12-R00, LXK2-PD12-S00 LXK2-PH12-R00, LXK2-PH12-S00 LXK2-PL12-P00, LXK2-PL12-Q00, LXK2-PL12-R00 Source: www.luxeon.com KINGBRIGHT: KA-3528ASYC Source: www.kingbright.com
Q101 Q102 = Transistoren:BSS138: N-CHANNEL MOS FET
R101 R102 R104 R105 R107-R114 R202 R204 R301-R306 R401-R403 = rcl:R-EU_: RESISTOR, European symbol
R103 R106 R201 R203 = stepRocker:R_NET_4X
SV101 = con-harting-ml:ML10: HARTING; OC_FARNELL: unknown; OC_NEWARK: unknown
T301-T304 = Transistoren:TMC1620: Dual N & P-Channel 60V Power MOSFET with low on-resistance and fast switching performance High energy efficiency and good thermal performance
TP1-TP5 = testpad:TP: Test pad
U$401 = Dioden:MSS1P6: SMT Schottky Barrier Rectifier 1A / 60V
X101 = con-cypressindustries:MINI-USB-SCHIELD-: MINI USB-B Conector Source: www.cypressindustries.com; OC_FARNELL: unknown; OC_NEWARK: unknown
X301 = stepRocker:RIACONNECT_183-04
X401 = stepRocker:TMC_POWER_CONNECTOR
Y101 = EBC_ucBoard_TE_v04:MYLIB_CRYSTAL-16MHZ-3.2X2.5

## Net classes
0 default: clearance 0.15 mm